# Altium schematic sheet OBD.SchDoc (part 3 of 3)
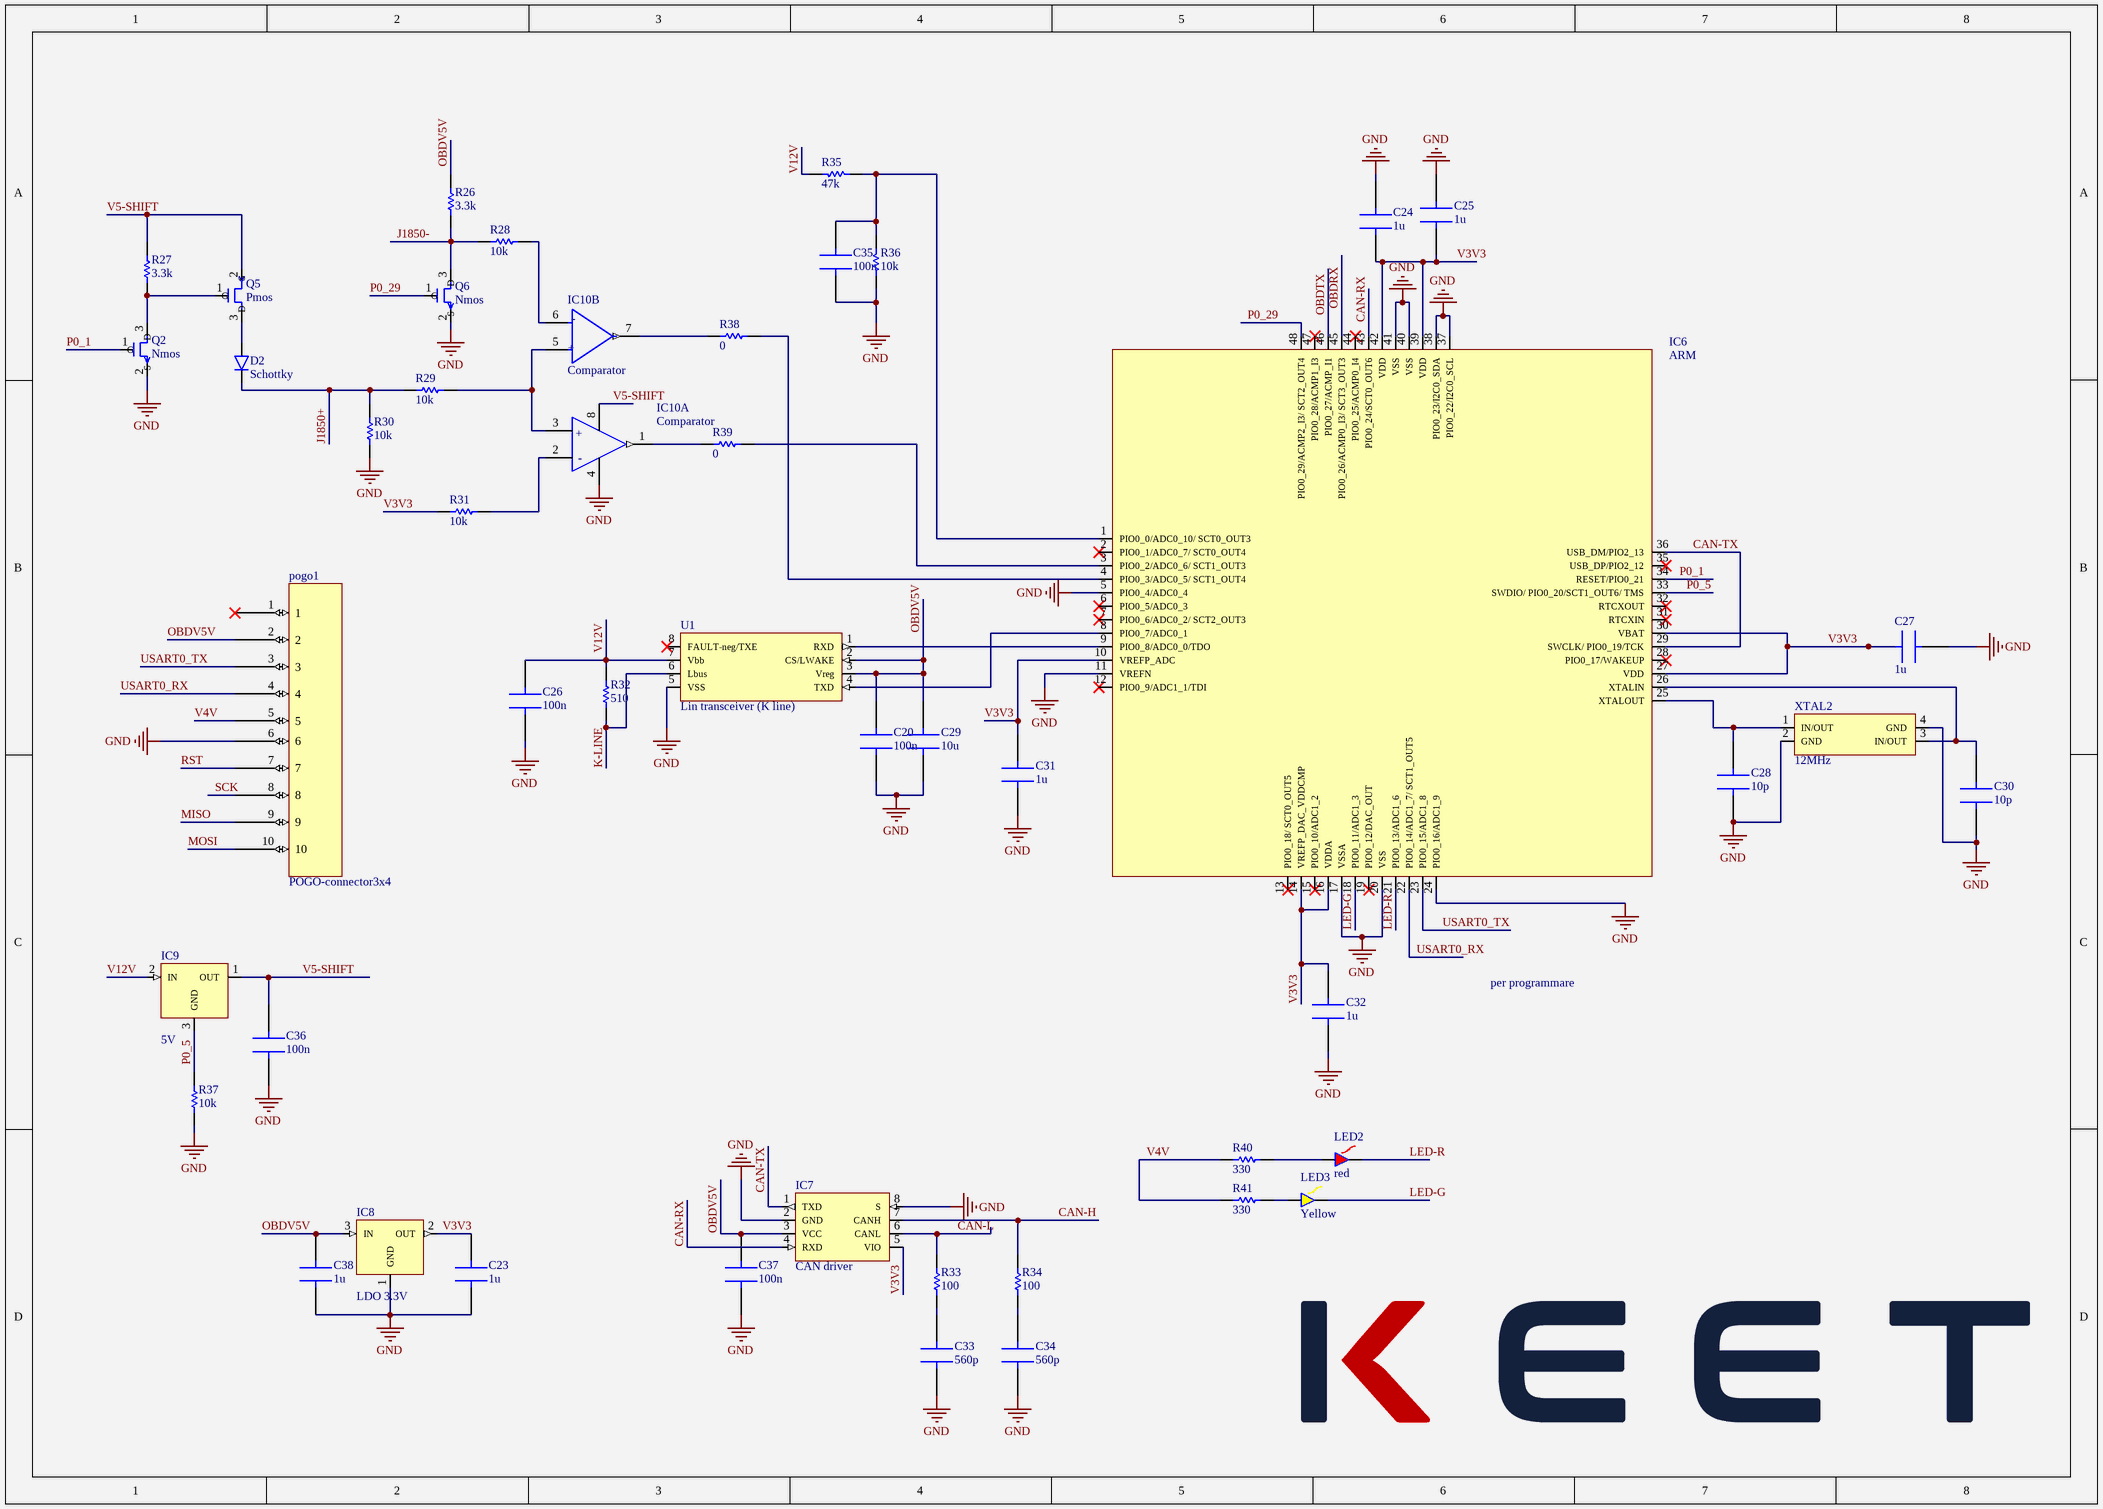
[diagram p2: OBD.SchDoc]

## Library data of the parts (continued)
R40 R41 = RC0402FR-07330RL: Res Thick Film 0402 330 Ohm 1% 0.063W(1/16W) ±100ppm/C Pad SMD T/R; Manufacturer: Yageo; Resistance: 330R; Temperature Coefficient: 100ppm/°C; Power Rating: 62.5mW; Voltage Rating: 50V; Max Power Dissipation: 63mW; Supplier 1: Mouser; Manufacturer Part Number: RC0402FR-07330RL; RoHS: Yes; Category: Chip SMD Resistors; Stock 1: 904299; Pricing 1: 1=0,10000, 10=0,01200, 50=0,01200, 100=0,00400, 1000=0,00400, 10000=0,00300 (USD); Case/Package: 0402; Case Code (Metric): 1005; Case Code (Imperial): 0402; Size Code: 0402; Min Operating Temperature: -55°C; Max Operating Temperature: 155°C; Packaging: Tape and Reel; Tolerance: 1%; Package Quantity: 1; Resistor Type: Thick Film; Number of Terminations: 2; Termination: SMD/SMT; Features: Moisture Resistant; Series: RC; Construction: Rectangular; Technology: THICK FILM; Resistance Tolerance: 1%; Length: 0.039inch; Width: 0.02inch; Height: 0.016inch; Depth: 0.5mm; RoHS Compliant: Yes; REACH SVHC: Unknown; Military Standard: Not; Lead Free: Lead Free; ComponentLink1URL: https://datasheet.ciiva.com/11819/0900766b80c66297-11819490.pdf?src-supplier=RSComponents; ComponentLink1Description: https://datasheet.ciiva.com/11819/0900766b80c66297-11819490.pdf?src-supplier=RSComponents; ComponentLink2URL: https://datasheet.ciiva.com/7849/1018594-7849962.pdf?src-supplier=Element14; ComponentLink2Description: https://datasheet.ciiva.com/7849/1018594-7849962.pdf?src-supplier=Element14; ComponentLink3URL: https://datasheet.ciiva.com/17083/pyu-rc0402-51-rohs-l-6-r-17083994.pdf?src-supplier=Future+Electronics; ComponentLink3Description: https://datasheet.ciiva.com/17083/pyu-rc0402-51-rohs-l-6-r-17083994.pdf?src-supplier=Future+Electronics; ComponentLink4URL: https://datasheet.ciiva.com/7849/1018594-7849963.pdf?src-supplier=Element14; ComponentLink4Description: https://datasheet.ciiva.com/7849/1018594-7849963.pdf?src-supplier=Element14; ComponentLink5URL: https://datasheet.ciiva.com/2453/pyu-r-int-thick-7-2453661.pdf?src-supplier=Digi-Key; ComponentLink5Description: https://datasheet.ciiva.com/2453/pyu-r-int-thick-7-2453661.pdf?src-supplier=Digi-Key; ComponentLink6URL: https://datasheet.ciiva.com/2453/pyu-r-int-thick-7-2453662.pdf?src-supplier=Digi-Key; ComponentLink6Description: https://datasheet.ciiva.com/2453/pyu-r-int-thick-7-2453662.pdf?src-supplier=Digi-Key; ComponentLink7URL: https://datasheet.ciiva.com/2453/pyu-r-int-thick-7-2453663.pdf?src-supplier=Digi-Key; ComponentLink7Description: https://datasheet.ciiva.com/2453/pyu-r-int-thick-7-2453663.pdf?src-supplier=Digi-Key; ComponentLink8URL: https://datasheet.ciiva.com/12656/pyu-rc0402-51-rohs-l-6-r-12656815.pdf?src-supplier=Mouser; ComponentLink8Description: https://datasheet.ciiva.com/12656/pyu-rc0402-51-rohs-l-6-r-12656815.pdf?src-supplier=Mouser; Supplier Part Number 1: 603-RC0402FR-07330RL
U1 = MCP2021-500E/SN: LIN Transceiver with Integrated Vreg 5V 20kBd Automotive 8-Pin SOIC N; Manufacturer: Microchip; Min Supply Voltage: 6V; Max Supply Voltage: 18V; Number of Transmitters: 1; Nominal Supply Current: 1mA; Supply Type: Single; Supplier 1: Mouser; Manufacturer Part Number: MCP2021-500E/SN; RoHS: Yes; Category: Logic ICs; Stock 1: 971; Pricing 1: 1=1,32000, 10=1,32000, 50=1,10000, 100=1,00000, 1000=1,00000, 10000=1,00000 (USD); Mount: Surface Mount; Case/Package: SOIC; Number of Pins: 8; Weight: 0.005044oz; Min Operating Temperature: -40°C; Max Operating Temperature: 125°C; Packaging: Rail/Tube; Package Quantity: 100; Number of Receivers: 1; Operating Supply Current: 1mA; Number of Transceivers: 1; Max Supply Current: 1mA; Length: 4.9mm; Width: 3.9mm; Height: 1.25mm; Radiation Hardening: No; REACH SVHC: No SVHC; Lead Free: Lead Free; ComponentLink1URL: https://datasheet.ciiva.com/1700/22018f-1700070.pdf?src-supplier=Digi-Key; ComponentLink1Description: https://datasheet.ciiva.com/1700/22018f-1700070.pdf?src-supplier=Digi-Key; ComponentLink2URL: https://datasheet.ciiva.com/3036/22018e-3036758.pdf?src-supplier=Avnet; ComponentLink2Description: https://datasheet.ciiva.com/3036/22018e-3036758.pdf?src-supplier=Avnet; ComponentLink3URL: https://datasheet.ciiva.com/1506/1789202-1506521.pdf?src-supplier=Element14; ComponentLink3Description: https://datasheet.ciiva.com/1506/1789202-1506521.pdf?src-supplier=Element14; ComponentLink4URL: https://datasheet.ciiva.com/16500/filehandler-aspxddocname-en557254-16500153.pdf?src-supplier=Future+Electronics; ComponentLink4Description: https://datasheet.ciiva.com/16500/filehandler-aspxddocname-en557254-16500153.pdf?src-supplier=Future+Electronics; Supplier Part Number 1: 579-MCP2021-500E/SN
XTAL2 = ECS-120-10-36B-CWY-TR: Crystal 12MHz ±10ppm (Tol) ±15ppm (Stability) 10pF FUND 130Ohm 4-Pin Mini-CSMD T/R; Manufacturer: ECS International; Supplier 1: Mouser; Manufacturer Part Number: ECS-120-10-36B-CWY-TR; RoHS: Yes; Stock 1: 1709; Pricing 1: 1=0,43000, 10=0,36300, 50=0,32700, 100=0,29000, 1000=0,23200, 10000=0,20300 (USD); Supplier Part Number 1: 520-120-10-36B-CWYT